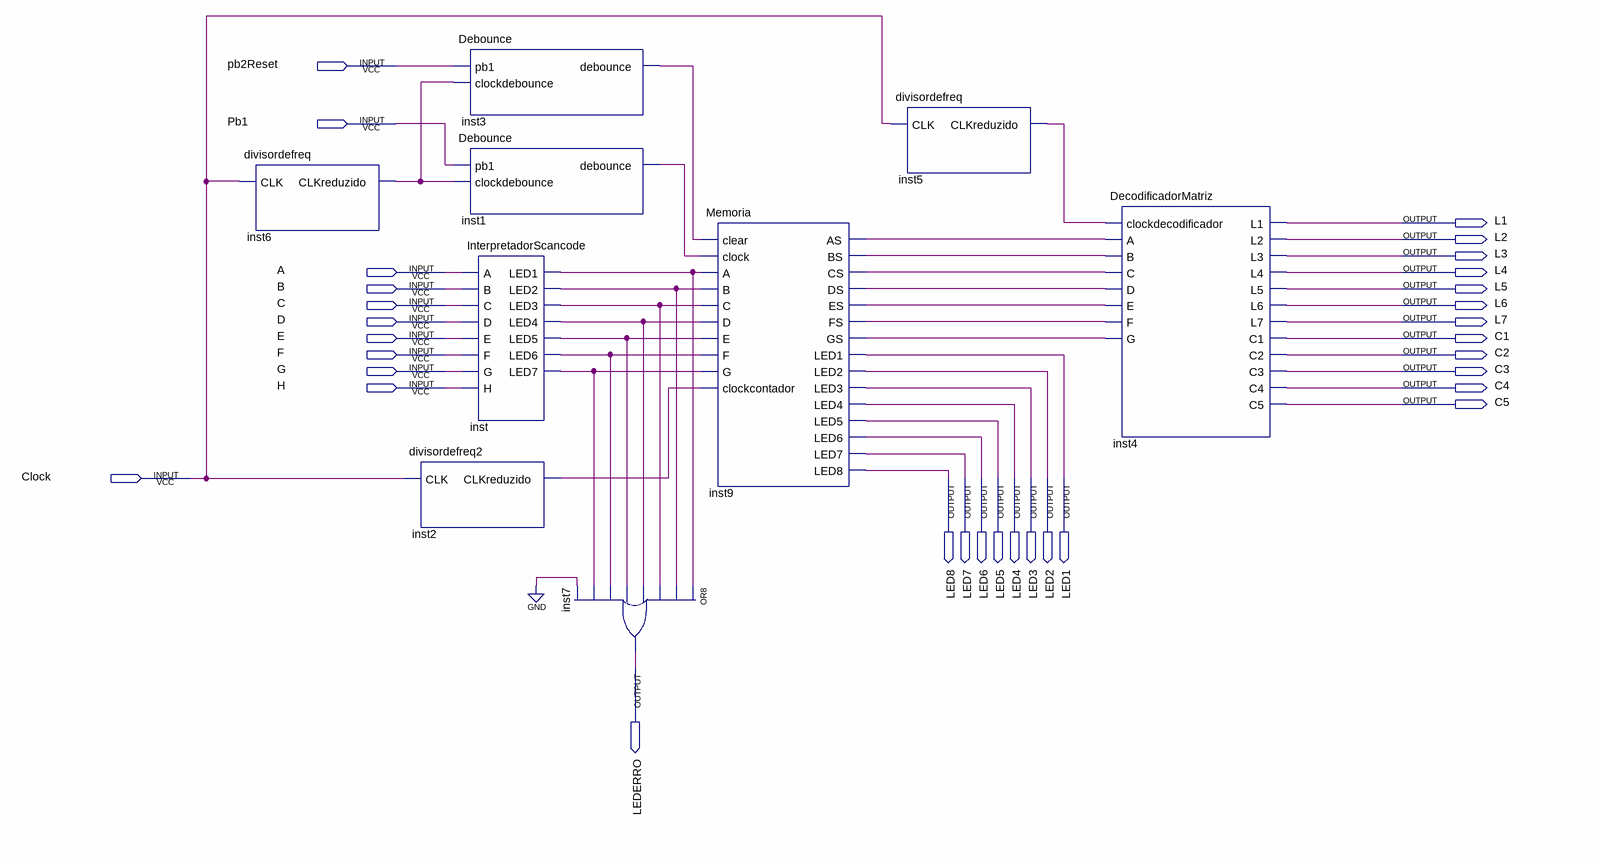
[diagram p0: schematic sheet]
// Quartus schematic VisualizadorAlphanumerico.bdf as structural Verilog: 9 symbols, 32 pins
module VisualizadorAlphanumerico (
  input  pb2Reset,
  input  Pb1,
  input  A,
  input  B,
  input  C,
  input  D,
  input  E,
  input  F,
  input  G,
  input  H,
  input  Clock,
  output L1,
  output L2,
  output L3,
  output L4,
  output L5,
  output L6,
  output L7,
  output C1,
  output C2,
  output C3,
  output C4,
  output C5,
  output LED8,
  output LED7,
  output LED6,
  output LED5,
  output LED4,
  output LED3,
  output LED2,
  output LED1,
  output LEDERRO
);

  wire inst1_debounce, inst2_clkreduzido, inst3_debounce, inst5_clkreduzido, inst6_clkreduzido, inst9_as,
       inst9_bs, inst9_cs, inst9_ds, inst9_es, inst9_fs, inst9_gs, inst_led1, inst_led2, inst_led3,
       inst_led4, inst_led5, inst_led6, inst_led7;

  divisordefreq inst6 (.CLK(Clock), .CLKreduzido(inst6_clkreduzido));
  Debounce inst3 (.pb1(pb2Reset), .clockdebounce(inst6_clkreduzido), .debounce(inst3_debounce));
  Debounce inst1 (.pb1(Pb1), .clockdebounce(inst6_clkreduzido), .debounce(inst1_debounce));
  divisordefreq2 inst2 (.CLK(Clock), .CLKreduzido(inst2_clkreduzido));
  InterpretadorScancode inst (
    .A(A), .B(B), .C(C), .D(D), .E(E), .F(F), .G(G), .H(H), .LED1(inst_led1), .LED2(inst_led2),
    .LED3(inst_led3), .LED4(inst_led4), .LED5(inst_led5), .LED6(inst_led6), .LED7(inst_led7));
  or inst7 (LEDERRO, inst_led1, inst_led2, inst_led3, inst_led4, inst_led5, inst_led6, inst_led7, 1'b0);
  Memoria inst9 (
    .clear(inst3_debounce), .clock(inst1_debounce), .A(inst_led1), .B(inst_led2), .C(inst_led3),
    .D(inst_led4), .E(inst_led5), .F(inst_led6), .G(inst_led7), .clockcontador(inst2_clkreduzido),
    .AS(inst9_as), .BS(inst9_bs), .CS(inst9_cs), .DS(inst9_ds), .ES(inst9_es), .FS(inst9_fs), .GS(inst9_gs),
    .LED1(LED1), .LED2(LED2), .LED3(LED3), .LED4(LED4), .LED5(LED5), .LED6(LED6), .LED7(LED7), .LED8(LED8));
  divisordefreq inst5 (.CLK(Clock), .CLKreduzido(inst5_clkreduzido));
  DecodificadorMatriz inst4 (
    .clockdecodificador(inst5_clkreduzido), .A(inst9_as), .B(inst9_bs), .C(inst9_cs), .D(inst9_ds),
    .E(inst9_es), .F(inst9_fs), .G(inst9_gs), .L1(L1), .L2(L2), .L3(L3), .L4(L4), .L5(L5), .L6(L6), .L7(L7),
    .C1(C1), .C2(C2), .C3(C3), .C4(C4), .C5(C5));
endmodule
